# Altium schematic sheet Top.SchDoc
size B
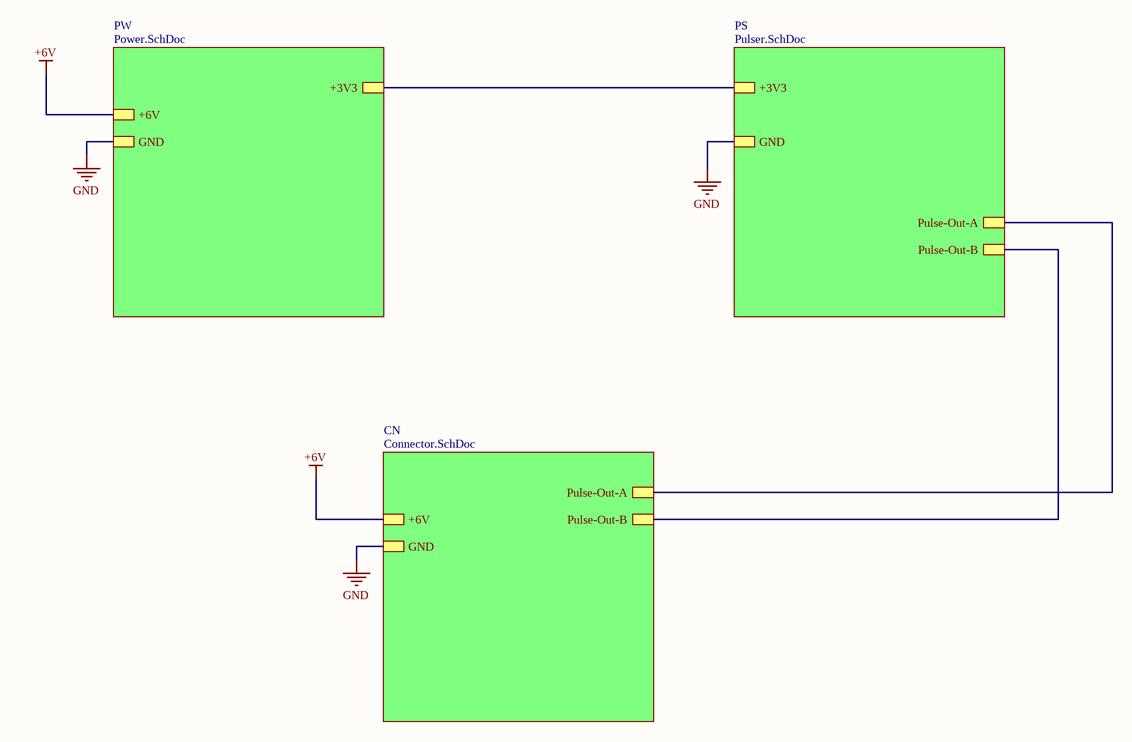
[diagram p0: Top.SchDoc]

## Sub-sheets
CN = Connector.SchDoc: GND, +6V, Pulse-Out-A, Pulse-Out-B
PS = Pulser.SchDoc: +3V3, GND, Pulse-Out-B, Pulse-Out-A
PW = Power.SchDoc: +6V, GND, +3V3

## Nets
+6V: sheet PW/+6V, sheet CN/+6V
GND: sheet PW/GND, sheet PS/GND, sheet CN/GND
(unnamed): sheet PW/+3V3, sheet PS/+3V3
(unnamed): sheet PS/Pulse-Out-B, sheet CN/Pulse-Out-B
(unnamed): sheet PS/Pulse-Out-A, sheet CN/Pulse-Out-A